# EAGLE design controller-board (EAGLE 9.6.2)
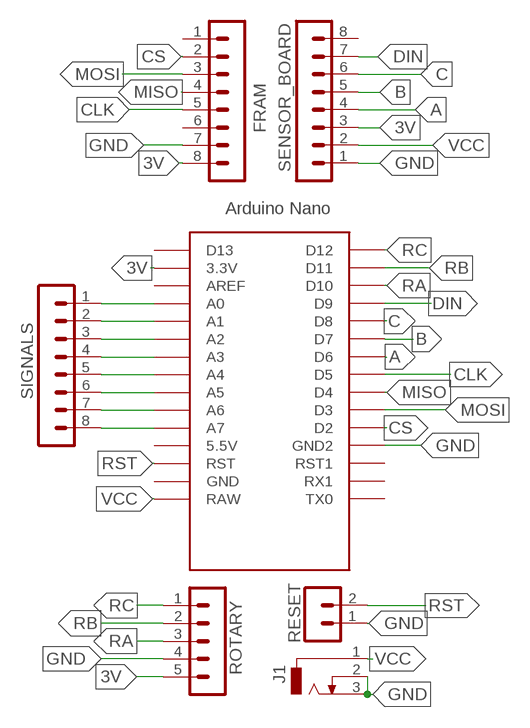
[diagram p0: schematic, sheet 1]

## Parts
ANALOG  SIGNALS  MA08-1  [MA08-1]
FRAM  FRAM  MA08-1  [MA08-1]
J1  DCJ0202  [DCJ0202]
RESET  B2B-PH-K  [B2B-PH-K]
ROTARY  B5B-PH-K  [B5B-PH-K]
SV2  SENSOR_BOARD  MA08-1  [MA08-1]
U$1  NANO  [NANO]

## Nets
3V: FRAM.8 ROTARY.5 SV2.3 U$1.3.3V
A: SV2.4 U$1.D6
A0: ANALOG.1 U$1.A0
A1: ANALOG.2 U$1.A1
A2: ANALOG.3 U$1.A2
A3: ANALOG.4 U$1.A3
A4: ANALOG.5 U$1.A4
A5: ANALOG.6 U$1.A5
A6: ANALOG.7 U$1.A6
A7: ANALOG.8 U$1.A7
B: SV2.5 U$1.D7
C: SV2.6 U$1.D8
CLK: FRAM.5 U$1.D5
CS: FRAM.2 U$1.D2
DIN: SV2.7 U$1.D9
GND: FRAM.7 J1.2 J1.3 RESET.1 ROTARY.4 SV2.1 U$1.GND1(GND2)
MISO: FRAM.4 U$1.D4
MOSI: FRAM.3 U$1.D3
RA: ROTARY.3 U$1.D10
RB: ROTARY.2 U$1.D11
RC: ROTARY.1 U$1.D12
RST: RESET.2 U$1.RST
VCC: J1.1 SV2.2 U$1.RAW
Unconnected: FRAM.1 FRAM.6 SV2.8 U$1.5V(5.5V) U$1.AREF U$1.D13 U$1.GND U$1.ICSP1 U$1.ICSP2 U$1.ICSP3 U$1.ICSP4 U$1.ICSP5 U$1.ICSP6 U$1.RST1 U$1.RX1 U$1.TX0

## Library data of the parts
ANALOG FRAM SV2 = con-lstb:MA08-1: PIN HEADER; OC_FARNELL: unknown; OC_NEWARK: unknown
J1 = con-jack:DCJ0202: DC POWER JACK Source: DCJ0202.pdf; OC_FARNELL: unknown; OC_NEWARK: unknown
RESET = con-jst-ph:B2B-PH-K: HEADER
ROTARY = con-jst-ph:B5B-PH-K: HEADER
U$1 = Arduino-clone:NANO: Arduino Nano

## Board
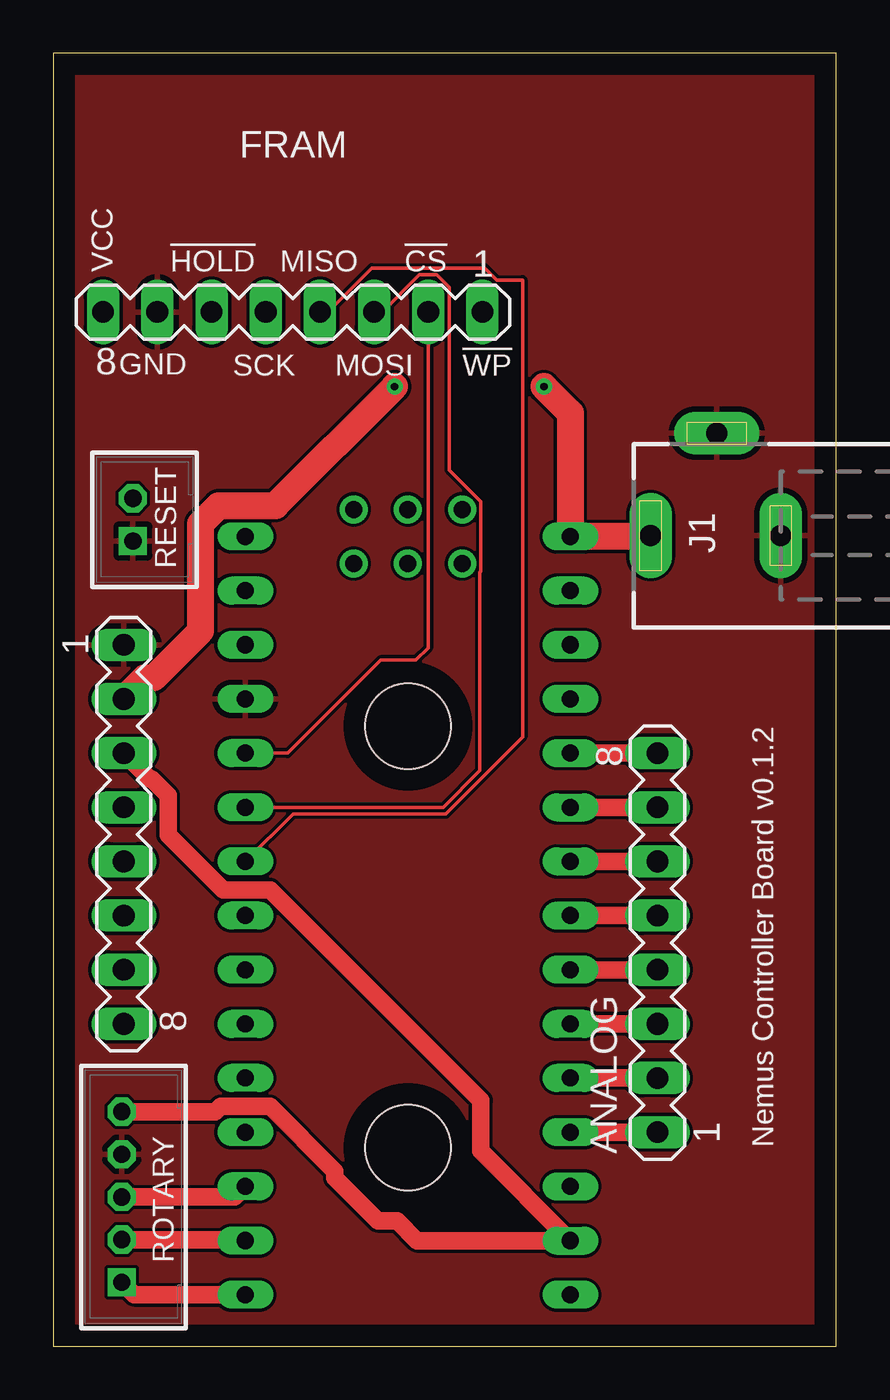
[diagram p1: board, top side]
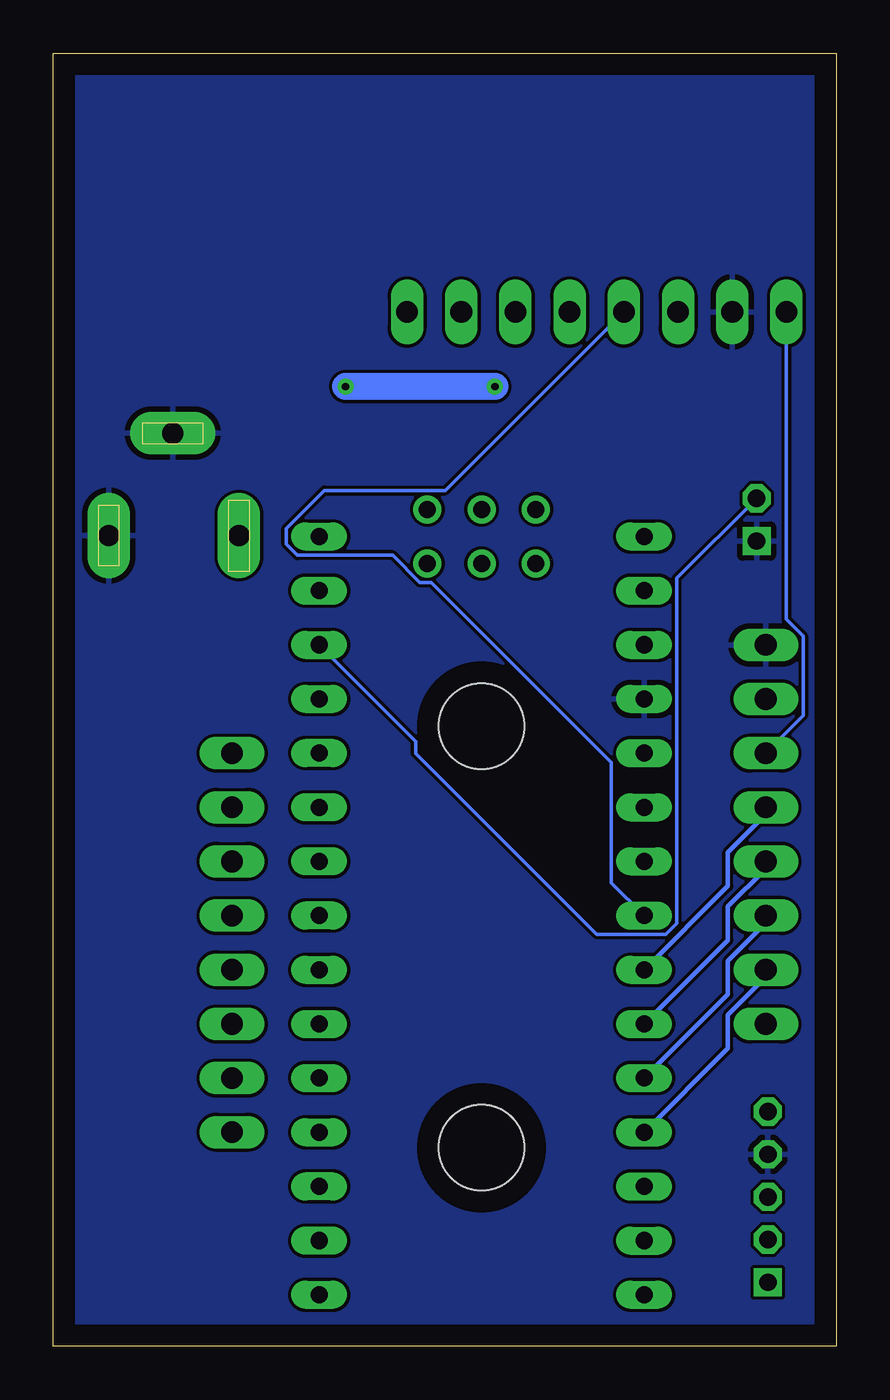
[diagram p2: board, bottom side, seen from below]

Size 36.7 x 60.63 mm. Coordinates in mm from the lower left corner, seen from the top.
Outline: 0,0 36.7,0 36.7,60.63 0,60.63 0,0
Copper layers (1*16): Top 0.035mm / dielectric 1.5mm / Bottom 0.035mm
Design rules "default": minimum track width 6mil, minimum drill 0.35mm, track to track 6mil, track to pad 6mil, pad to pad 6mil, via to via 6mil, smd to smd 6mil, copper to edge 40mil, drill to drill 6mil, minimum pad ring 10mil, minimum via ring 8mil, stop-mask expansion 4mil, vias tented up to drill 0mil, thermal gap 10mil
Holes 4 mm at 16.62,9.3 16.62,29.08

### Footprints (pad centres in the part's own frame; a part is rotated, then mirrored left to right if it is on the bottom)
MA08-1 = drill 1.016 long: 1 -8.89,0; 2 -6.35,0; 3 -3.81,0; 4 -1.27,0; 5 1.27,0; 6 3.81,0; 7 6.35,0; 8 8.89,0
DCJ0202 = drill 1 pad 2 long: 1 0,3.1; 2 4.8,0; 3 0,-3
B2B-PH-K = drill 0.813 square: 1 -1,0 | drill 0.813 octagon: 2 1,0
B5B-PH-K = drill 0.813 square: 1 -4,0 | drill 0.813 octagon: 2 -2,0; 3 0,0; 4 2,0; 5 4,0
NANO = drill 0.8 long: 3.3V -10.16,24.13; 5V -10.16,-1.27; A0 -10.16,19.05; A1 -10.16,16.51; A2 -10.16,13.97; A3 -10.16,11.43; A4 -10.16,8.89; A5 -10.16,6.35; A6 -10.16,3.81; A7 -10.16,1.27; AREF -10.16,21.59; D2 5.08,1.27; D3 5.08,3.81; D4 5.08,6.35; D5 5.08,8.89; D6 5.08,11.43; D7 5.08,13.97; D8 5.08,16.51; D9 5.08,19.05; D10 5.08,21.59; D11 5.08,24.13; D12 5.08,26.67; D13 -10.16,26.67; GND -10.16,-6.35; GND1 5.08,-1.27; RAW -10.16,-8.89; RST -10.16,-3.81; RST1 5.08,-3.81; RX1 5.08,-6.35; TX0 5.08,-8.89 | drill 0.8: ICSP1 -5.08,-10.16; ICSP2 -5.08,-7.62; ICSP3 -2.54,-10.16; ICSP4 -2.54,-7.62; ICSP5 0,-10.16; ICSP6 0,-7.62

### Placement (x,y rotation side)
ANALOG  28.32,18.92 90 top
FRAM  11.22,48.5 180 top
J1  31.1,38.01 90 top
RESET  3.73,38.76 90 top
ROTARY  3.2,7 90 top
SV2  3.3,24 270 top
U$1  14.08,29.08 180 top

### Tracks (layer width: path | path; a pad name or v marks a point on that pad's centre or on a via)
3V
  Top 0.813: ROTARY.5 7.6,11 7.85,11.25 10.16,11.25 13.2,8.21 13.2,7.88 15.2,5.88 16.12,5.88 17.05,4.95 U$1.3.3V 20.04,9.15 20.04,11.52 10.16,21.41 7.96,21.41 5.38,23.98 5.38,25.82 4.61,26.59 4.52,26.59 SV2.3
  Bottom 0.152: FRAM.8 2.33,34.09 1.55,33.3 1.55,29.57 SV2.3
A
  Bottom 0.203: U$1.D6 5.08,21.57 5.08,23.15 3.3,24.93 SV2.4
A0
  Top 0.813: ANALOG.1 U$1.A0
A1
  Top 0.813: ANALOG.2 U$1.A1
A2
  Top 0.813: ANALOG.3 U$1.A2
A3
  Top 0.813: ANALOG.4 U$1.A3
A4
  Top 0.813: ANALOG.5 U$1.A4
A5
  Top 0.813: ANALOG.6 U$1.A5
A6
  Top 0.813: ANALOG.7 U$1.A6
A7
  Top 0.813: ANALOG.8 U$1.A7
B
  Bottom 0.203: U$1.D7 5.08,19.04 5.08,20.61 3.3,22.39 SV2.5
C
  Bottom 0.203: U$1.D8 5.08,16.5 5.08,18.07 3.3,19.85 SV2.6
CLK
  Bottom 0.152: U$1.D5 10.54,21.73 10.54,27.37 18.99,35.82 19.53,35.82 20.8,37.09 25.26,37.09 25.78,37.61 25.78,38.34 23.99,40.13 18.33,40.13 FRAM.5
CS
  Top 0.152: FRAM.2 17.57,32.75 17,32.17 15.34,32.17 10.98,27.81 U$1.D2
DIN
  Bottom 0.2: SV2.7 3.3,17.31
  Bottom 0.203: U$1.D9 5.08,13.96 5.08,15.53 3.3,17.31
GND
  pour Bottom: 0,0 0,60.58 36.72,60.58 36.72,0
  pour Top: 0,0 0,60.58 36.72,60.58 36.72,0
MISO
  Top 0.152: FRAM.4 12.87,48.5 14.93,50.55 20.22,50.55 20.78,50 22,50 22,28.57 18.4,24.97 11.24,24.97 U$1.D4
MOSI
  Top 0.152: FRAM.3 15.41,48.5 17.16,50.25 17.98,50.25 18.57,49.67 18.57,41.09 20.05,39.61 20.05,36.34 20,36.29 20,27 18.27,25.27 U$1.D3
RA
  Top 0.813: ROTARY.3 8.51,7 U$1.D10
RB
  Top 0.813: ROTARY.2 8.96,5 U$1.D11
RC
  Top 0.813: ROTARY.1 3.79,2.41 U$1.D12
RST
  Bottom 0.152: U$1.RST 19.71,28.36 19.71,27.8 11.22,19.31 7.98,19.31 7.46,19.83 7.46,36.02 RESET.2
VCC  (via drill 0.35)
  Top 1.27: J1.1 27.96,37.97 U$1.RAW 24.24,43.76 v23,45 | SV2.2 4.29,31.34 4.71,31.34 6.91,33.54 6.91,38.57 7.75,39.41 10.41,39.41 v16,45
  Bottom 1.27: v16,45 v23,45

### Text on the board
tPlace: VCC | !HOLD | MISO | !CS | GND | SCK | MOSI | !WP | Nemus Controller Board v0.1.2
tValues: GND | 5V | 3V | A | B | C | LEDO
202bmp: /Users/admin/Documents/EAGLE/projects/haptic-harpsichord-cad/logo/logobw_small.bmp